# Altium project Load controll by esp32.PrjPcb
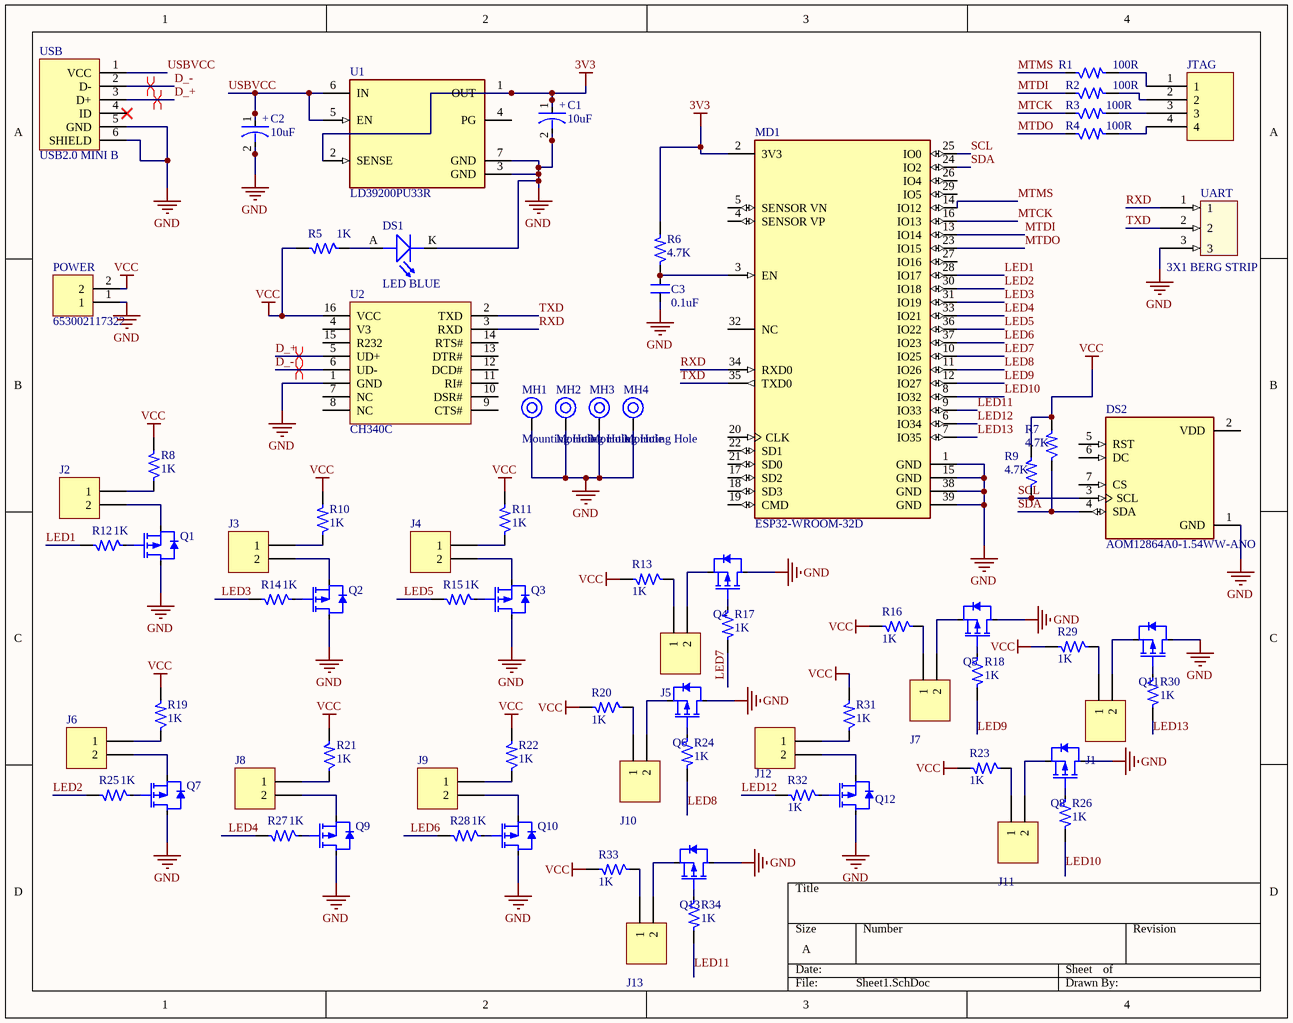
[diagram p0: Sheet1.SchDoc]
1 sheet, 76 parts. Net scope: global (net labels, ports and power ports of the same name join across sheets).
Board file: PCB1.PcbDoc

## Sheet Sheet1.SchDoc
size A; SheetNumber: 1; SheetTotal: 1

### Parts
C1  10uF  [ACAP_P339_D393_H531_RAD]
C2  10uF  [ACAP_P339_D393_H531_RAD]
C3  0.1uF  [CAP_0805]
DS1  LED BLUE  [LED_0805]
DS2  AOM12864A0-1.54WW-ANO  [LCD_AOM12864A0-1.54WW-ANO]
J1  2X1 TERMINAL BLOCK  [CON2_P137_691103110002_TH_ST]  (value not drawn)
J2  2X1 TERMINAL BLOCK  [CON2_P137_691103110002_TH_ST]  (value not drawn)
J3  2X1 TERMINAL BLOCK  [CON2_P137_691103110002_TH_ST]  (value not drawn)
J4  2X1 TERMINAL BLOCK  [CON2_P137_691103110002_TH_ST]  (value not drawn)
J5  2X1 TERMINAL BLOCK  [CON2_P137_691103110002_TH_ST]  (value not drawn)
J6  2X1 TERMINAL BLOCK  [CON2_P137_691103110002_TH_ST]  (value not drawn)
J7  2X1 TERMINAL BLOCK  [CON2_P137_691103110002_TH_ST]  (value not drawn)
J8  2X1 TERMINAL BLOCK  [CON2_P137_691103110002_TH_ST]  (value not drawn)
J9  2X1 TERMINAL BLOCK  [CON2_P137_691103110002_TH_ST]  (value not drawn)
J10  2X1 TERMINAL BLOCK  [CON2_P137_691103110002_TH_ST]  (value not drawn)
J11  2X1 TERMINAL BLOCK  [CON2_P137_691103110002_TH_ST]  (value not drawn)
J12  2X1 TERMINAL BLOCK  [CON2_P137_691103110002_TH_ST]  (value not drawn)
J13  2X1 TERMINAL BLOCK  [CON2_P137_691103110002_TH_ST]  (value not drawn)
JTAG  4X1 BERG STRIP  [CON4_100_40D72_TH_ST_MALE]  (value not drawn)
MD1  ESP32-WROOM-32D  [FP-ESP32-WROOM-32D-MFG]
MH1  Mounting Hole  [MOUNTING]
MH2  Mounting Hole  [MOUNTING]
MH3  Mounting Hole  [MOUNTING]
MH4  Mounting Hole  [MOUNTING]
POWER  653002117322  [CON2_50_653002117322_TH_RA]
Q1  SUD19P06-60-GE3  [TO-252_181_255_118X62_SMD]  (value not drawn)
Q2  SUD19P06-60-GE3  [TO-252_181_255_118X62_SMD]  (value not drawn)
Q3  SUD19P06-60-GE3  [TO-252_181_255_118X62_SMD]  (value not drawn)
Q4  SUD19P06-60-GE3  [TO-252_181_255_118X62_SMD]  (value not drawn)
Q5  SUD19P06-60-GE3  [TO-252_181_255_118X62_SMD]  (value not drawn)
Q6  SUD19P06-60-GE3  [TO-252_181_255_118X62_SMD]  (value not drawn)
Q7  SUD19P06-60-GE3  [TO-252_181_255_118X62_SMD]  (value not drawn)
Q8  SUD19P06-60-GE3  [TO-252_181_255_118X62_SMD]  (value not drawn)
Q9  SUD19P06-60-GE3  [TO-252_181_255_118X62_SMD]  (value not drawn)
Q10  SUD19P06-60-GE3  [TO-252_181_255_118X62_SMD]  (value not drawn)
Q11  SUD19P06-60-GE3  [TO-252_181_255_118X62_SMD]  (value not drawn)
Q12  SUD19P06-60-GE3  [TO-252_181_255_118X62_SMD]  (value not drawn)
Q13  SUD19P06-60-GE3  [TO-252_181_255_118X62_SMD]  (value not drawn)
R1  100R  [RES_0603]
R2  100R  [RES_0603]
R3  100R  [RES_0603]
R4  100R  [RES_0603]
R5  1K  [RES_0603]
R6  4.7K  [RES_0603]
R7  4.7K  [RES_0603]
R8  1K  [RES_0603]
R9  4.7K  [RES_0603]
R10  1K  [RES_0603]
R11  1K  [RES_0603]
R12  1K  [RES_0603]
R13  1K  [RES_0603]
R14  1K  [RES_0603]
R15  1K  [RES_0603]
R16  1K  [RES_0603]
R17  1K  [RES_0603]
R18  1K  [RES_0603]
R19  1K  [RES_0603]
R20  1K  [RES_0603]
R21  1K  [RES_0603]
R22  1K  [RES_0603]
R23  1K  [RES_0603]
R24  1K  [RES_0603]
R25  1K  [RES_0603]
R26  1K  [RES_0603]
R27  1K  [RES_0603]
R28  1K  [RES_0603]
R29  1K  [RES_0603]
R30  1K  [RES_0603]
R31  1K  [RES_0603]
R32  1K  [RES_0603]
R33  1K  [RES_0603]
R34  1K  [RES_0603]
U1  LD39200PU33R  [FP-DFN6-7946637-MFG]
U2  CH340C  [SOIC16_50_284_25X90_SMT]
UART  3X1 BERG STRIP  [CON3_100_40D72_TH_ST-MALE]
USB  USB2.0 MINI B  [CON_690-005-299-043]

### Nets
3V3: C1.1 MD1.2(3V3) R6.2 U1.1(OUT) U1.2(SENSE)
GND: C1.2 C2.2 C3.1 DS1.K(CATHODE) DS2.1(GND) MD1.1(GND) MD1.15(GND) MD1.38(GND) MD1.39(GND) MH1.1 MH2.1 MH3.1 MH4.1 POWER.1 Q1.2(S) Q2.2(S) Q3.2(S) Q4.2(S) Q5.2(S) Q6.2(S) Q7.2(S) Q8.2(S) Q9.2(S) Q10.2(S) Q11.2(S) Q12.2(S) Q13.2(S) U1.3(GND) U1.7(GND) U2.1(GND) UART.3 USB.5(GND) USB.6(SHIELD)
VCC: POWER.2 R5.2 R7.2 R8.2 R9.2 R10.2 R11.2 R13.2 R16.2 R19.2 R20.2 R21.2 R22.2 R23.2 R29.2 R31.2 R33.2 U2.16(VCC)
D_+: U2.5(UD+) USB.3(D+)
D_-: U2.6(UD-) USB.2(D-)
LED1: MD1.28(IO17) R12.2
LED2: MD1.30(IO18) R25.2
LED3: MD1.31(IO19) R14.2
LED4: MD1.33(IO21) R27.2
LED5: MD1.36(IO22) R15.2
LED6: MD1.37(IO23) R28.2
LED7: MD1.10(IO25) R17.2
LED8: MD1.11(IO26) R24.2
LED9: MD1.12(IO27) R18.2
LED10: MD1.8(IO32) R26.2
LED11: MD1.9(IO33) R34.2
LED12: MD1.6(IO34) R32.2
LED13: MD1.7(IO35) R30.2
MTCK: MD1.16(IO13) R3.1
MTDI: MD1.13(IO14) R2.1
MTDO: MD1.23(IO15) R4.1
MTMS: MD1.14(IO12) R1.1
RXD: MD1.34(RXD0) U2.3(RXD) UART.1
SCL: DS2.3(SCL) MD1.25(IO0) R9.1
SDA: DS2.4(SDA) MD1.24(IO2) R7.1
TXD: MD1.35(TXD0) U2.2(TXD) UART.2
USBVCC: C2.1 U1.5(EN) U1.6(IN) USB.1(VCC)
NetC3_2: C3.2 MD1.3(EN) R6.1
NetDS1_A: DS1.A(ANODE) R5.1
NetJ1_1: J1.1 R29.1
NetJ1_2: J1.2 Q11.3(D)
NetJ2_1: J2.1 R8.1
NetJ2_2: J2.2 Q1.3(D)
NetJ3_1: J3.1 R10.1
NetJ3_2: J3.2 Q2.3(D)
NetJ4_1: J4.1 R11.1
NetJ4_2: J4.2 Q3.3(D)
NetJ5_1: J5.1 R13.1
NetJ5_2: J5.2 Q4.3(D)
NetJ6_1: J6.1 R19.1
NetJ6_2: J6.2 Q7.3(D)
NetJ7_1: J7.1 R16.1
NetJ7_2: J7.2 Q5.3(D)
NetJ8_1: J8.1 R21.1
NetJ8_2: J8.2 Q9.3(D)
NetJ9_1: J9.1 R22.1
NetJ9_2: J9.2 Q10.3(D)
NetJ10_1: J10.1 R20.1
NetJ10_2: J10.2 Q6.3(D)
NetJ11_1: J11.1 R23.1
NetJ11_2: J11.2 Q8.3(D)
NetJ12_1: J12.1 R31.1
NetJ12_2: J12.2 Q12.3(D)
NetJ13_1: J13.1 R33.1
NetJ13_2: J13.2 Q13.3(D)
NetJTAG_1: JTAG.1 R1.2
NetJTAG_2: JTAG.2 R2.2
NetJTAG_3: JTAG.3 R3.2
NetJTAG_4: JTAG.4 R4.2
NetQ1_1: Q1.1(G) R12.1
NetQ2_1: Q2.1(G) R14.1
NetQ3_1: Q3.1(G) R15.1
NetQ4_1: Q4.1(G) R17.1
NetQ5_1: Q5.1(G) R18.1
NetQ6_1: Q6.1(G) R24.1
NetQ7_1: Q7.1(G) R25.1
NetQ8_1: Q8.1(G) R26.1
NetQ9_1: Q9.1(G) R27.1
NetQ10_1: Q10.1(G) R28.1
NetQ11_1: Q11.1(G) R30.1
NetQ12_1: Q12.1(G) R32.1
NetQ13_1: Q13.1(G) R34.1

Not connected (* = marked no-connect by the designer): DS2 2(VDD) 5(RST) 6(DC) 7(CS); MD1 4(SENSOR_VP) 5(SENSOR_VN) 17(SD2) 18(SD3) 19(CMD) 20(CLK) 21(SD0) 22(SD1) 26(IO4) 27(IO16) 29(IO5) 32(NC); U1 4(PG); U2 4(V3) 7(NC) 8(NC) 9(CTS#) 10(DSR#) 11(RI#) 12(DCD#) 13(DTR#) 14(RTS#) 15(R232); USB 4(ID)*

### Layout directives
differential pair; differential pair class DIFFPAIR; rule Differential Pairs Routing [Pref Gap = 5mil    Min Gap  = 5mil    Max Gap  = 5milPref Width = 10mil    Min Width  = 10mil    Max Width  = 10mil]: D_+, D_-

### Notes on the sheet
- (in symbol CAP-P_10uF-400V-20%-RAD) +

### Library data of the parts
C1 C2 = CAP-P_10uF-400V-20%-RAD: 10µF 400V Aluminum Electrolytic Capacitors Radial, Can - SMD 10000 Hrs @ 105°C; Manufacturer: Nichicon; Manufacturer Part Number: ULV2G100MNL1GS; Alternate Part Number-1: NA; Case/Package: Radial-SMD; Supplier-1: SP ROAD; Supplier Part Number-1: ULV2G100MNL1GS
C3 = CAP_0.1uF-50V-5%-0805: 0.1µF ±5% 50V Ceramic Capacitor X7R 0805 (2012 Metric); Manufacturer: AVX Corporation; Manufacturer Part Number: 08055C104JAT4A; Alternate Part Number-1: 0805B104M500; Case/Package: 0805; Supplier-1: SIRICOM; Supplier Part Number-1: 0805B104J500CT
DS1 = LED_BLUE-3V3-20mA-0805: Blue 470nm LED Indication - Discrete 3.3V 0805 (2012 Metric); Manufacturer: Vishay Lite-On; Manufacturer Part Number: LTST-C171TBKT; Alternate Part Number-1: NA; Case/Package: 0805; Supplier-1: SP ROAD; Supplier Part Number-1: LTST-C171TBKT
DS2 = AOM12864A0-1.54WW-ANO: Non-Touch Graphic LCD Display Module - White OLED SPI 1.54 (39.12mm) 128 x 64; MF: Orient Display; Price: None; Value: *; Package: None; Check_prices: https://www.snapeda.com/parts/AOM12864A0-1.54WW-ANO/Orient+Display/view-part/?ref=eda; SnapEDA_Link: https://www.snapeda.com/parts/AOM12864A0-1.54WW-ANO/Orient+Display/view-part/?ref=snap; Purchase-URL: https://pricing.snapeda.com/search/part/AOM12864A0-1.54WW-ANO/?ref=eda; Availability: In Stock; MP: AOM12864A0-1.54WW-ANO
J1-J13 = CON-TB_2X1-137-ST-TH: 2 Pins, 1 Row 137mil Pitch, straight Connector, male; Manufacturer: Wurth Electronics; Manufacturer Part Number: 691103110002; Alternate Part Number-1: NA; Case/Package: TH-CON; Supplier-1: SP ROAD; Supplier Part Number-1: 691103110002
JTAG = CON-BS-PLG_4X1-100-ST-TH: 4 Pins, 1 Row 2.54mm Pitch, Straight bergstrip, Male; Manufacturer: NA; Manufacturer Part Number: NA; Case/Package: TH-CON; Supplier-1: SP ROAD; Supplier Part Number-1: NA; Alternate Part Number-1: NA
MD1 = CMP-194065-000003-1: WIFI MODULE 32MBITS SPI FLASH; Manufacturer: Espressif Systems; Max Supply Voltage: 3.6V; Nominal Supply Current: 500mA; Max Frequency: 2484MHz; Number Of Adc Channels: 16; Number Of Gpio: 32; Interface: I2C,SPI,UART,Ethernet,I2S,Other; Data Rate: 150Mbits/s; Min Supply Voltage: 3V; Bandwidth: 72MHz; Sensitivity: -98dBm; Octopart: https://octopart.com/esp32-wroom-32d-espressif+systems-91040050; Package: ESP32-WROOM-32D; ComponentLink2URL: https://www.espressif.com/sites/default/files/documentation/esp32-wroom-32d_esp32-wroom-32u_datasheet_en.pdf; Lead Free: Yes; Category: UNK; Mouser Description: Wi-Fi/BT BLE Module ESP32-D0WD, SPI Flash, UART, P; Device Class L1: Integrated Circuits (ICs); RoHS: TRUE; Temperature Range Low: -40°C; ComponentLink2Description: Datasheet; Digikey Description: WIFI MODULE 32MBITS SPI FLASH; Height: 3.2mm; Temperature: -40°C to +85°C; Manufacturer Part Number: ESP32-WROOM-32D; Device Class L3: Transceivers; Device Class L2: RF Semiconductors and Devices; Temperature Range High: +85°C; Automotive: No
MH1-MH4 = MH_3.5H_6D: Manufacturer Part Number: NA; Case/Package: TH; Manufacturer: NA; Supplier-1: NA; Supplier Part Number-1: NA; Alternate Part Number-1: NA
POWER = CON-PLG_2X1-50-RA-TH: 1 Pins, 1 Row 256mil Pitch, Straight, Male; Manufacturer: JST; Mating Part Number: 653002113322; Crimp Part Number: 653153128130; Alternate Part Number-1: NA; Manufacturer Part Number: 653002117322; Case/Package: TH-CON; Supplier-1: WURTH; Supplier Part Number-1: 653002117322
Q1-Q13 = MOSFET-P_60V-18A-TO252: P-Channel 60V 18.3A (Tc) 2.3W (Ta), 38.5W (Tc) Surface Mount TO-252, (D-Pak); Manufacturer: Vishay Siliconix; Alternate Part Number-1: DMP3028LK3-13; Manufacturer Part Number: SUD19P06-60-GE3; Case/Package: TO252; Supplier-1: Mouser; Supplier Part Number-1: 781-SUD19P06-60-GE3
R1-R4 = RES_100R-0.1W-1%-0603: 100 Ohms ±1% 0.1W, 1/10W Chip Resistor 0603 (1608 Metric) Thick Film; Manufacturer: Walsin; Manufacturer Part Number: WR06X1000FTL; Alternate Part Number-1: MR06X1000FTL; Case/Package: 0603; Supplier-1: SIRICOM; Supplier Part Number-1: WALSIN:WR06X1000FTL
R5 R8 R10-R34 = RES_1K-0.1W-1%-0603: 1 kOhms ±1% 0.1W, 1/10W Chip Resistor 0603 (1608 Metric) Automotive AEC-Q200 Thick Film; Manufacturer: Walsin; Manufacturer Part Number: WR06X1001FTL; Alternate Part Number-1: 0603WAF1001T5E; Case/Package: 0603; Supplier-1: SIRICOM; Supplier Part Number-1: WR06X1001FTL
R6 R7 R9 = RES_4.7K-0.1W-1%-0603: 4.7 kOhms ±1% 0.1W, 1/10W Chip Resistor 0603 (1608 Metric) Moisture Resistant Thick Film; Manufacturer: Walsin; Manufacturer Part Number: WR06X4701FTL; Alternate Part Number-1: MR06X4701FTL; Case/Package: 0603; Supplier-1: SIRICOM; Supplier Part Number-1: WR06X4701FTL
U1 = CMP-12153-000011-1: IC REG LINEAR 3.3V 2A 6DFN; Number of Outputs: 1; Max Input Voltage: 6V; Output Type: Fixed; Min Input Voltage: 1.25V; Dropout Voltage: 130mV; Operating Supply Current: 1mA; Number of Regulators: 1; Case/Package: DFN; Packaging: Tape and Reel; Output Current: 2A; Min Operating Temperature: -40°C; Mount: Surface Mount; Output Voltage: 3.3V; Max Operating Temperature: 125°C; Lead Free: Lead Free; Package Quantity: 3000
U2 = IC_CH340C: USB Bridge, USB to UART USB 2.0 UART Interface; Manufacturer: Olimex; Alternate Part Number-1: NA; Manufacturer Part Number: CH340C; Case/Package: SOIC16; Supplier-1: LCSC; Supplier Part Number-1: C84681
UART = CON-BS-PLG_3X1-100-ST-TH: 3 Pins, 1 Row 2.54mm Pitch, Straight bergstrip, Male; Manufacturer: NA; Manufacturer Part Number: RKI-1140; Case/Package: TH-CON; Supplier-1: SP ROAD; Supplier Part Number-1: NA; Alternate Part Number-1: NA
USB = CON_USB2.0-MINIB-SMD: USB - mini B USB 2.0 Receptacle Connector 5 Position Surface Mount, Right Angle; Manufacturer: EDAC; Manufacturer Part Number: 690-005-299-043; Alternate Part Number-1: NA; Case/Package: USB-MINI-B; Supplier-1: LCSC; Supplier Part Number-1: C105424